# EAGLE schematic Central Board (EAGLE 8.3.2)
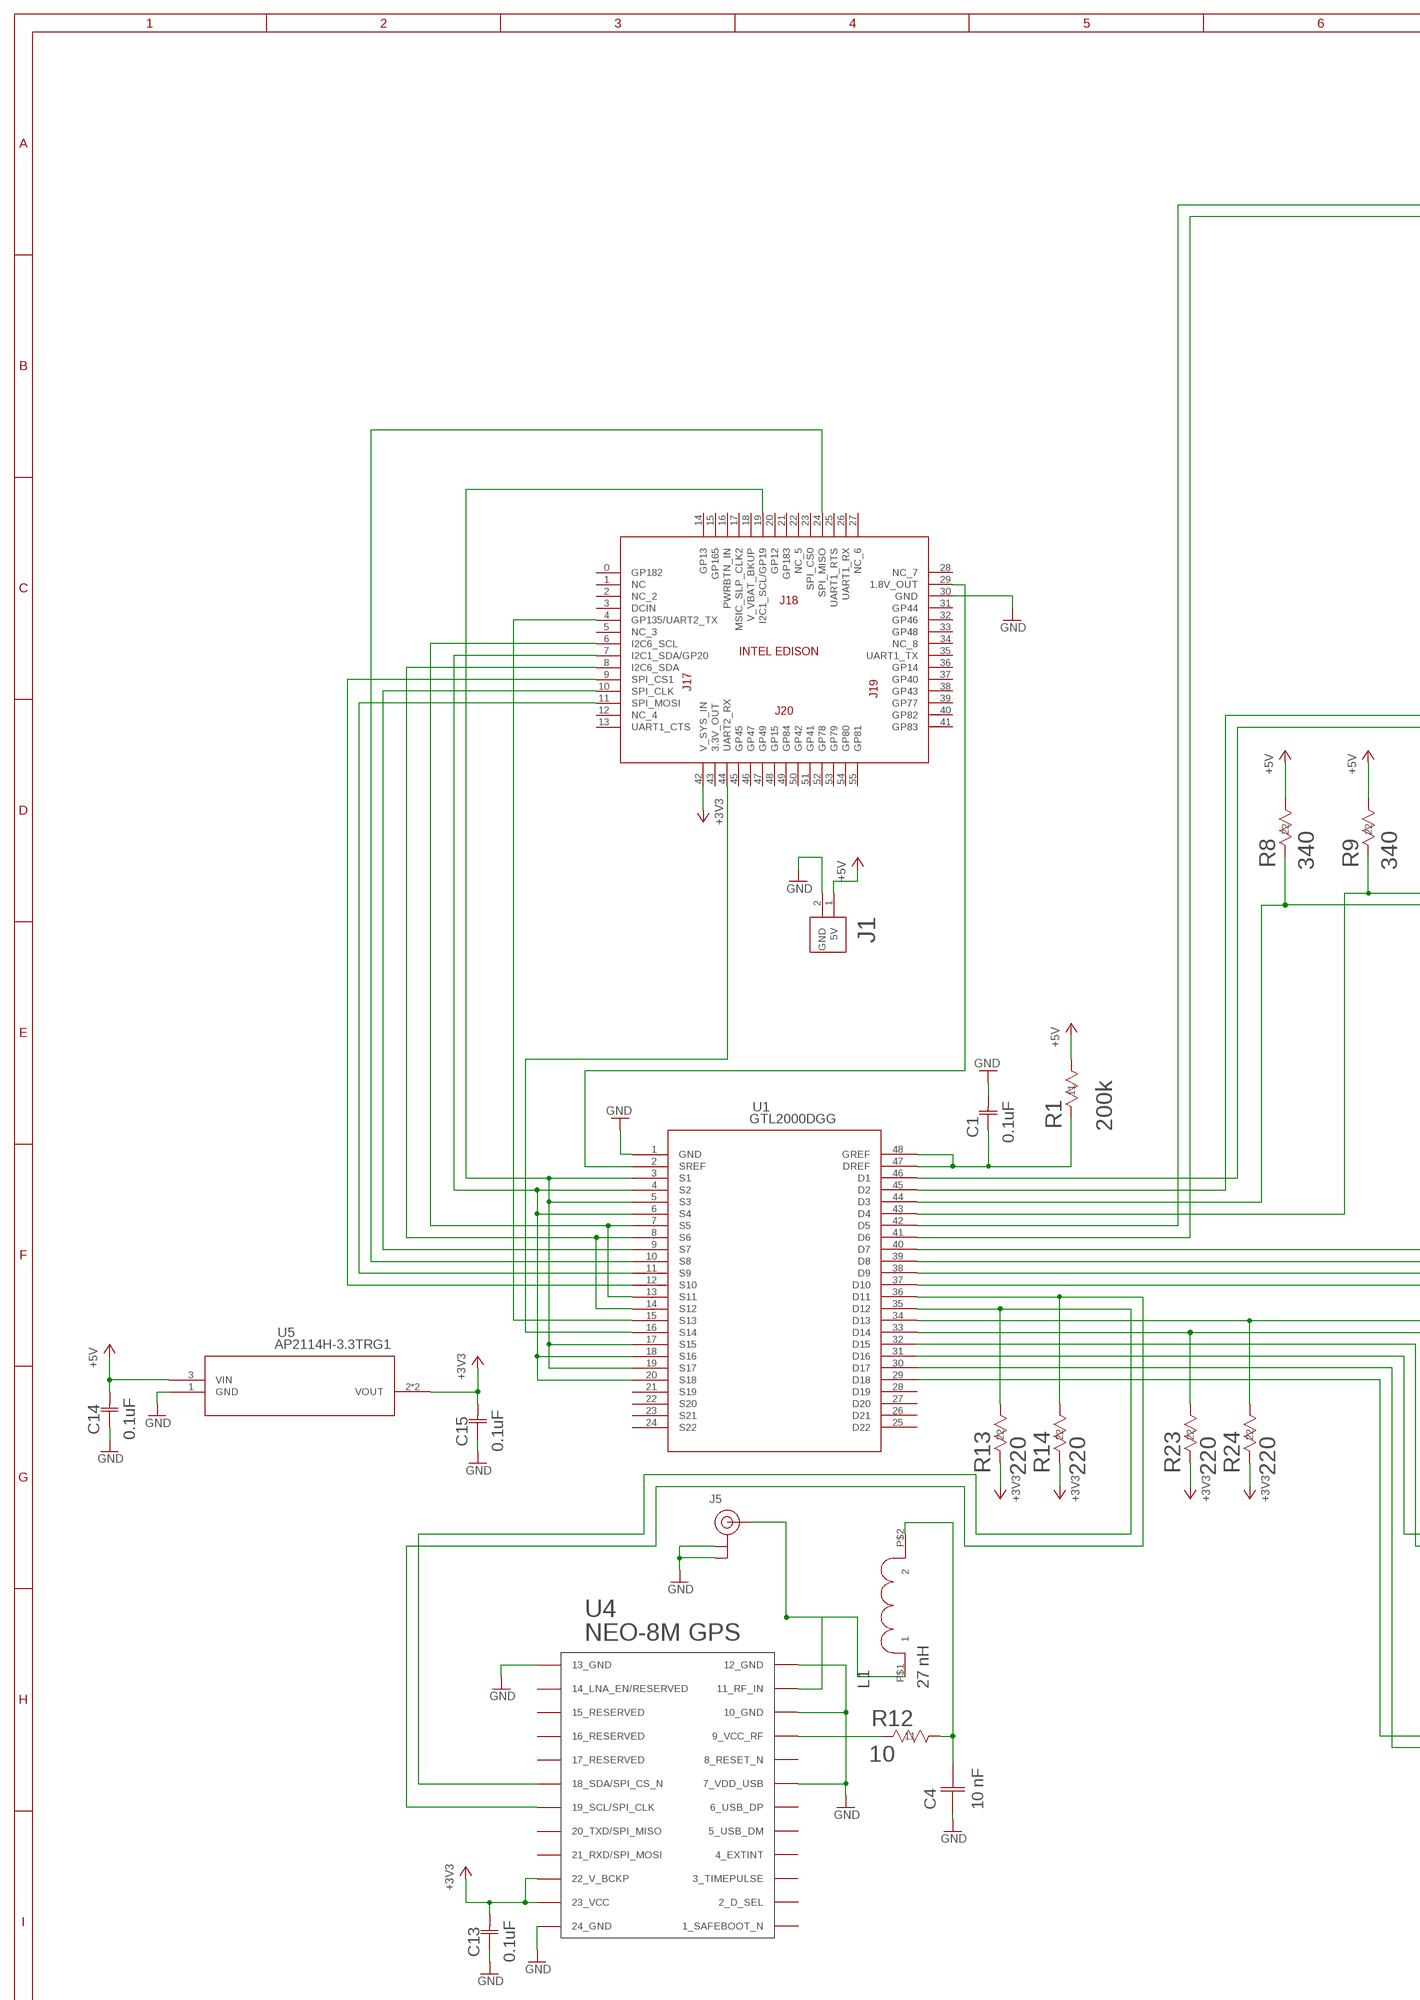
[diagram p0: schematic, sheet 1, part 1 of 2]
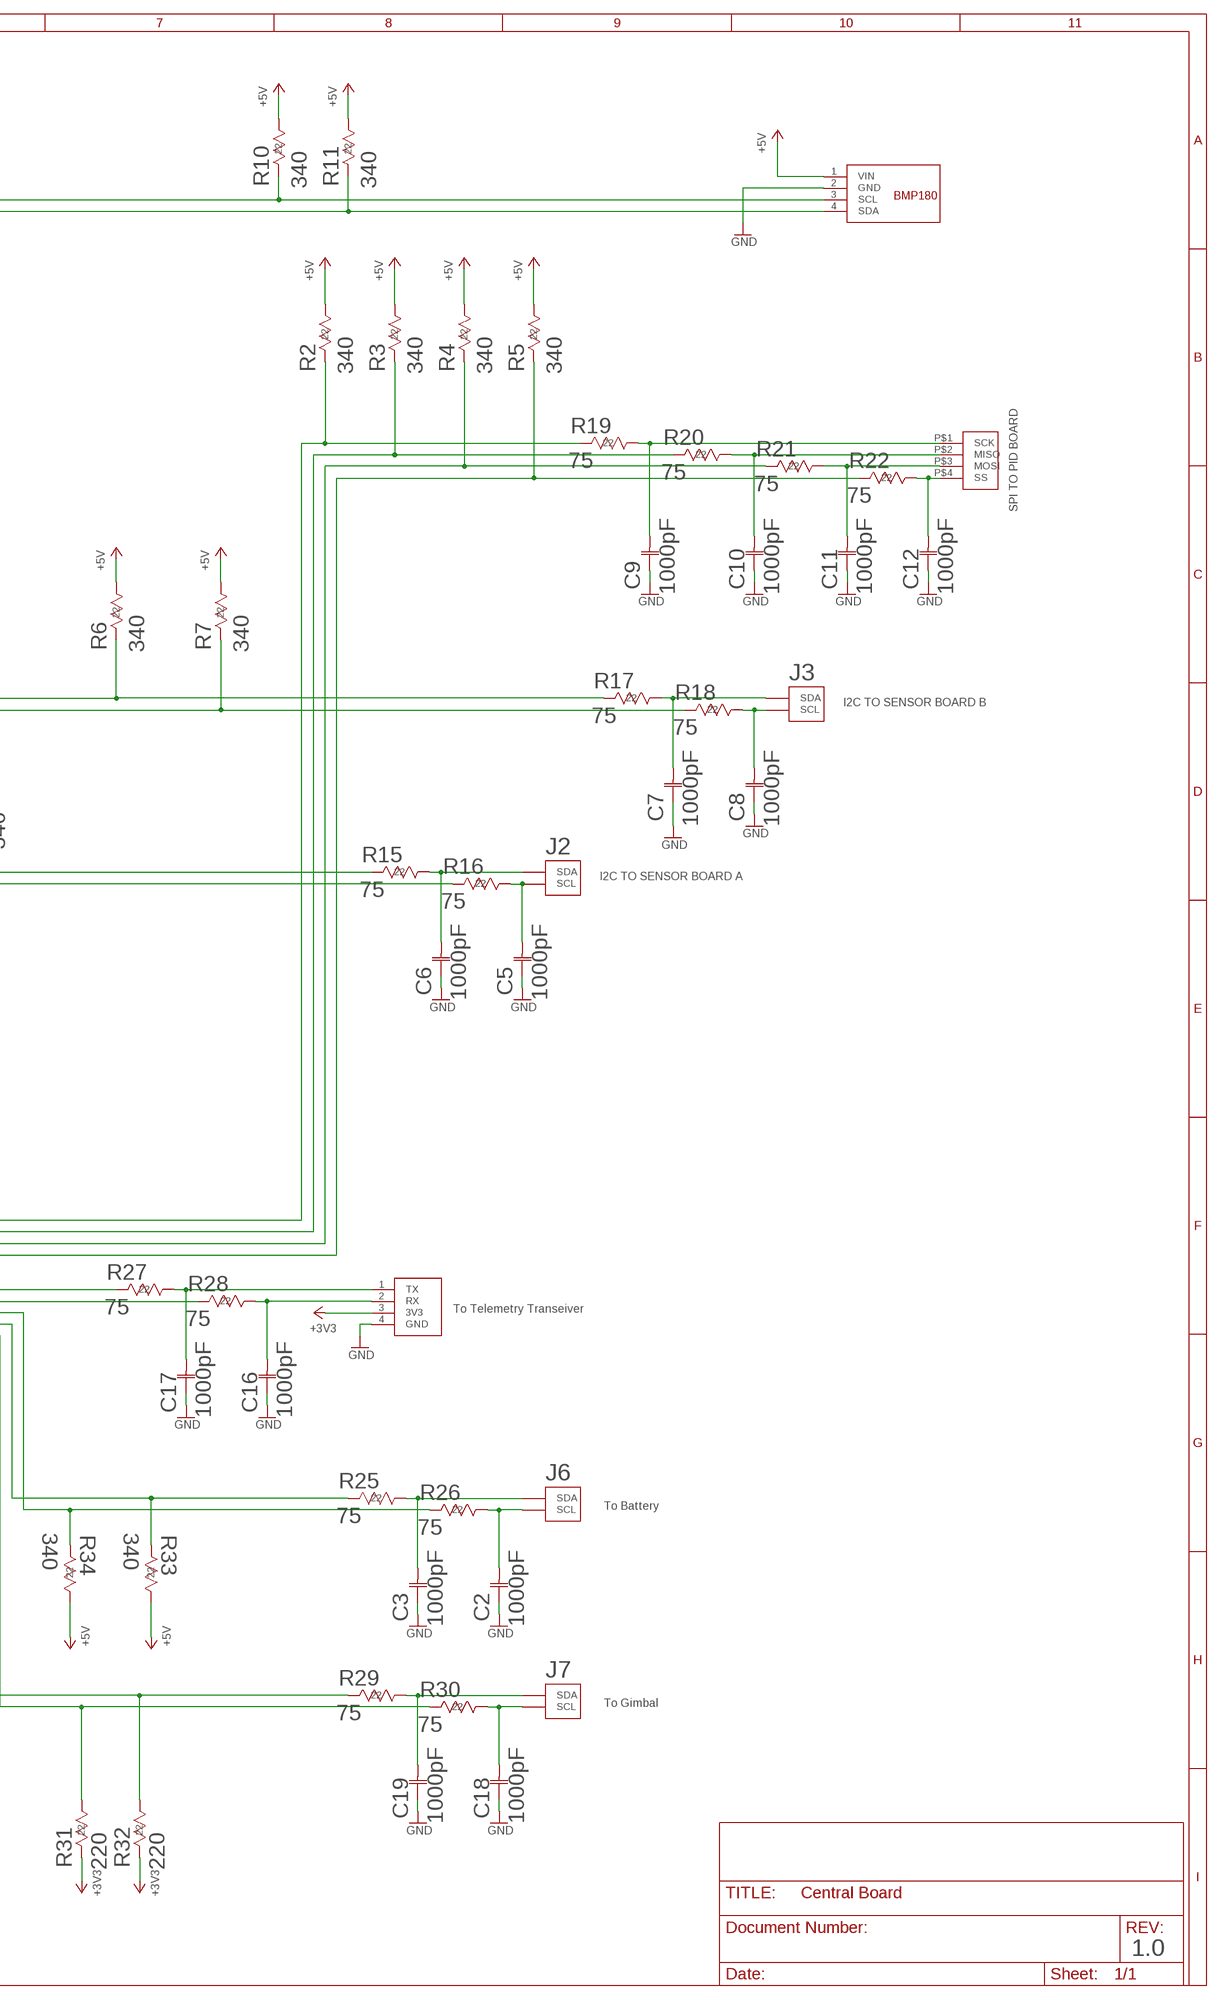
[diagram p1: schematic, sheet 1, part 2 of 2]

## Parts
C1  0.1uF  08055C104KAT2A  [0805]
C2  1000pF  GRM155R60J102KA01DG-155-M  [G-155-M]
C3  1000pF  GRM155R60J102KA01DG-155-M  [G-155-M]
C4  10 nF  10NF_CAPACITOR  [0603_CAPACITOR]
C5  1000pF  GRM155R60J102KA01DG-155-M  [G-155-M]
C6  1000pF  GRM155R60J102KA01DG-155-M  [G-155-M]
C7  1000pF  GRM155R60J102KA01DG-155-M  [G-155-M]
C8  1000pF  GRM155R60J102KA01DG-155-M  [G-155-M]
C9  1000pF  GRM155R60J102KA01DG-155-M  [G-155-M]
C10  1000pF  GRM155R60J102KA01DG-155-M  [G-155-M]
C11  1000pF  GRM155R60J102KA01DG-155-M  [G-155-M]
C12  1000pF  GRM155R60J102KA01DG-155-M  [G-155-M]
C13  0.1uF  08055C104KAT2A  [0805]
C14  0.1uF  08055C104KAT2A  [0805]
C15  0.1uF  08055C104KAT2A  [0805]
C16  1000pF  GRM155R60J102KA01DG-155-M  [G-155-M]
C17  1000pF  GRM155R60J102KA01DG-155-M  [G-155-M]
C18  1000pF  GRM155R60J102KA01DG-155-M  [G-155-M]
C19  1000pF  GRM155R60J102KA01DG-155-M  [G-155-M]
J1  POWER_CONNECTOR  [XH_CONNECTOR]
J2  I2C_CONNECTOR  [XH_CONNECTOR]
J3  I2C_CONNECTOR  [XH_CONNECTOR]
J4  SPI_CONNECTOR  [JST-XH_4POS]
J5  U.FL  [U.FL]
J6  I2C_CONNECTOR  [XH_CONNECTOR]
J7  I2C_CONNECTOR  [XH_CONNECTOR]
L1  27 nH  27NH_INDUCTOR  [0402_INDUCTOR]
R1  200k  RMCF0603FT200K  [STA_RMCF0603]
R2  340  RC0603FR-07340RL  [RC0603N]
R3  340  RC0603FR-07340RL  [RC0603N]
R4  340  RC0603FR-07340RL  [RC0603N]
R5  340  RC0603FR-07340RL  [RC0603N]
R6  340  RC0603FR-07340RL  [RC0603N]
R7  340  RC0603FR-07340RL  [RC0603N]
R8  340  RC0603FR-07340RL  [RC0603N]
R9  340  RC0603FR-07340RL  [RC0603N]
R10  340  RC0603FR-07340RL  [RC0603N]
R11  340  RC0603FR-07340RL  [RC0603N]
R12  10  RNCP0805FTD10R0STA_RNCP0805-M  [STA_RNCP0805-M]
R13  220  RC0603JR-07220RLRC0603N-M  [RC0603N-M]
R14  220  RC0603JR-07220RLRC0603N-M  [RC0603N-M]
R15  75  RC0402JR-0775RLRC0402N-M  [RC0402N-M]
R16  75  RC0402JR-0775RLRC0402N-M  [RC0402N-M]
R17  75  RC0402JR-0775RLRC0402N-M  [RC0402N-M]
R18  75  RC0402JR-0775RLRC0402N-M  [RC0402N-M]
R19  75  RC0402JR-0775RLRC0402N-M  [RC0402N-M]
R20  75  RC0402JR-0775RLRC0402N-M  [RC0402N-M]
R21  75  RC0402JR-0775RLRC0402N-M  [RC0402N-M]
R22  75  RC0402JR-0775RLRC0402N-M  [RC0402N-M]
R23  220  RC0603JR-07220RLRC0603N-M  [RC0603N-M]
R24  220  RC0603JR-07220RLRC0603N-M  [RC0603N-M]
R25  75  RC0402JR-0775RLRC0402N-M  [RC0402N-M]
R26  75  RC0402JR-0775RLRC0402N-M  [RC0402N-M]
R27  75  RC0402JR-0775RLRC0402N-M  [RC0402N-M]
R28  75  RC0402JR-0775RLRC0402N-M  [RC0402N-M]
R29  75  RC0402JR-0775RLRC0402N-M  [RC0402N-M]
R30  75  RC0402JR-0775RLRC0402N-M  [RC0402N-M]
R31  220  RC0603JR-07220RLRC0603N-M  [RC0603N-M]
R32  220  RC0603JR-07220RLRC0603N-M  [RC0603N-M]
R33  340  RC0603FR-07340RL  [RC0603N]
R34  340  RC0603FR-07340RL  [RC0603N]
U1  GTL2000DGG  [SOT362-1]
U3  INTEL_EDISON  [INTEL_EDISON]
U4  NEO-M8  [NEO-M8]
U5  AP2114H-3.3TRG1  [SOT-223]
U9  BMP180_BARO  [BMP180_BARO]
U$1  4_PIN_TELE_CONNECTOR  [4_PIN_TELE_CONNECTOR]

## Nets
+3V3: C13.2 C15.2 R13.2 R14.2 R23.2 R24.2 R31.2 R32.2 U3.42(V_SYS_IN) U4.22(22_V_BCKP) U4.23(23_VCC) U5.2(VOUT) U5.4(VOUT) U$1.3(3V3)
+5V: C14.2 J1.1(5V) R1.2 R2.1 R3.1 R4.1 R5.1 R6.1 R7.1 R8.1 R9.1 R10.1 R11.1 R33.1 R34.1 U5.3(VIN) U9.1(VIN)
GND: C1.2 C2.1 C3.1 C4.1 C5.1 C6.1 C7.1 C8.1 C9.1 C10.1 C11.1 C12.1 C13.1 C14.1 C15.1 C16.1 C17.1 C18.1 C19.1 J1.2(GND) J5.P$1(GND) J5.P$2(GND) U1.1(GND) U3.30(GND) U4.7(7_VDD_USB) U4.10(10_GND) U4.12(12_GND) U4.13(13_GND) U4.24(24_GND) U5.1(GND) U9.2(GND) U$1.4(GND)
N$1: J5.P$3(SIGNAL) L1.P$1 U4.11(11_RF_IN)
N$2: U1.3(S1) U1.5(S3) U1.17(S15) U1.19(S17) U3.19(I2C1_SCL/GP19)
N$3: U1.4(S2) U1.6(S4) U1.18(S16) U1.20(S18) U3.7(I2C1_SDA/GP20)
N$4: R7.2 R18.2 U1.46(D1)
N$5: R6.2 R17.2 U1.45(D2)
N$6: C18.2 J7.1(SCL) R30.1
N$7: R9.2 R15.2 U1.43(D4)
N$8: U1.7(S5) U1.13(S11) U3.6(I2C6_SCL)
N$9: U1.8(S6) U1.14(S12) U3.8(I2C6_SDA)
N$10: R10.2 U1.42(D5) U9.3(SCL)
N$11: U1.2(SREF) U3.29(1.8V_OUT)
N$12: R14.1 U1.36(D11) U4.19(19_SCL/SPI_CLK)
N$13: R12.1 U4.9(9_VCC_RF)
N$14: R11.2 U1.41(D6) U9.4(SDA)
N$15: U1.9(S7) U3.10(SPI_CLK)
N$16: C19.2 J7.2(SDA) R29.1
N$17: U1.10(S8) U3.24(SPI_MISO)
N$18: U1.16(S14) U3.44(UART2_RX)
N$19: U1.11(S9) U3.11(SPI_MOSI)
N$20: U1.15(S13) U3.4(GP135/UART2_TX)
N$21: U1.12(S10) U3.9(SPI_CS1)
N$22: R23.1 R28.2 U1.33(D14)
N$23: C1.1 R1.1 U1.47(DREF) U1.48(GREF)
N$24: R24.1 R27.2 U1.34(D13)
N$26: C4.2 L1.P$2 R12.2
N$27: R13.1 U1.35(D12) U4.18(18_SDA/SPI_CS_N)
N$28: C5.2 J2.1(SCL) R16.1
N$29: R8.2 R16.2 U1.44(D3)
N$30: C6.2 J2.2(SDA) R15.1
N$31: C8.2 J3.1(SCL) R18.1
N$32: C7.2 J3.2(SDA) R17.1
N$33: R30.2 R31.1 U1.30(D17)
N$34: C12.2 J4.P$4(SS) R22.1
N$35: C11.2 J4.P$3(MOSI) R21.1
N$36: C9.2 J4.P$1(SCK) R19.1
N$37: C10.2 J4.P$2(MISO) R20.1
N$38: C2.2 J6.1(SCL) R26.1
N$39: R29.2 R32.1 U1.29(D18)
N$40: C3.2 J6.2(SDA) R25.1
N$42: C16.2 R28.1 U$1.2(RX)
N$43: R25.2 R33.2 U1.31(D16)
N$44: C17.2 R27.1 U$1.1(TX)
N$45: R26.2 R34.2 U1.32(D15)
N$52: R5.2 R22.2 U1.37(D10)
N$53: R4.2 R21.2 U1.38(D9)
N$54: R3.2 R20.2 U1.39(D8)
N$55: R2.2 R19.2 U1.40(D7)
Unconnected: U1.21(S19) U1.22(S20) U1.23(S21) U1.24(S22) U1.25(D22) U1.26(D21) U1.27(D20) U1.28(D19) U3.0(GP182) U3.1(NC) U3.2(NC_2) U3.5(NC_3) U3.12(NC_4) U3.13(UART1_CTS) U3.14(GP13) U3.15(GP165) U3.20(GP12) U3.21(GP183) U3.22(NC_5) U3.23(SPI_CS0) U3.25(UART1_RTS) U3.26(UART1_RX) U3.27(NC_6) U3.28(NC_7) U3.31(GP44) U3.32(GP46) U3.33(GP48) U3.34(NC_8) U3.35(UART1_TX) U3.36(GP14) U3.37(GP40) U3.38(GP43) U3.39(GP77) U3.40(GP82) U3.41(GP83) U3.45(GP45) U3.46(GP47) U3.47(GP49) U3.48(GP15) U3.49(GP84) U3.50(GP42) U3.51(GP41) U3.52(GP78) U3.53(GP79) U3.54(GP80) U3.55(GP81) U4.1(1_SAFEBOOT_N) U4.2(2_D_SEL) U4.3(3_TIMEPULSE) U4.4(4_EXTINT) U4.5(5_USB_DM) U4.6(6_USB_DP) U4.8(8_RESET_N) U4.14(14_LNA_EN/RESERVED) U4.15(15_RESERVED) U4.16(16_RESERVED) U4.17(17_RESERVED) U4.20(20_TXD/SPI_MISO) U4.21(21_RXD/SPI_MOSI)

## Notes on the sheet
- SPI TO PID BOARD
- I2C TO SENSOR BOARD B
- I2C TO SENSOR BOARD A
- To Telemetry Transeiver
- To Battery
- To Gimbal
- 1.0

## Power pins joined to a net without a drawn wire
3.3V_OUT: U3.43(3.3V_OUT)
DCIN: U3.3(DCIN)
MSIC_SLP_CLK2: U3.17(MSIC_SLP_CLK2)
PWRBTN_IN: U3.16(PWRBTN_IN)
V_VBAT_BKUP: U3.18(V_VBAT_BKUP)

## Library data of the parts
C1 C13-C15 = 0.1uF X7R Ceramic Capacitor:08055C104KAT2A; COPYRIGHT: Copyright C 2015 Accelerated Designs. All rights reserved; MANUFACTURER_PART_NUMBER: 08055C104KAT2A; VENDOR: Vendor
C2 C3 C5-C12 C16-C19 = 1000pF-capacitor:GRM155R60J102KA01D; COPYRIGHT: Copyright C 2015 Accelerated Designs. All rights reserved; MANUFACTURER_PART_NUMBER: GRM155R60J102KA01D; VENDOR: Vendor
C4 = thanics_robotics:10NF_CAPACITOR
J1 = thanics_robotics:POWER_CONNECTOR
J2 J3 J6 J7 = thanics_robotics:I2C_CONNECTOR
J4 = thanics_robotics:SPI_CONNECTOR
J5 = SparkFun-Connectors:U.FL: SMD Antenna Connector - U.FL 2mm height, 3.0mm x 3.0mm receptacle size. SparkFun Products: SparkFun WiFi Shield - ESP8266 <https://www.sparkfun.com/products/13287> SparkFun ESP8266 Thing <https://www.sparkfun.com/products/13231> SparkFun MiniGen - Pro Mini Signal Generator Shield <https://www.sparkfun.com/products/11420>; PROD_ID: CONN-09193; SF_ID: WRL-09144
L1 = thanics_robotics:27NH_INDUCTOR
R1 = 200k-resistor:RMCF0603FT200K; COPYRIGHT: Copyright C 2015 Accelerated Designs. All rights reserved; MANUFACTURER_PART_NUMBER: RMCF0603FT200K; VENDOR: Vendor
R2-R11 R33 R34 = 340-resistor:RC0603FR-07340RL; CASE: 0603 1608 metric; COMPOSITION: Thick Film; COPYRIGHT: Copyright C 2015 Accelerated Designs. All rights reserved; DATASHEET: httpwww.yageo.comdocumentsrecentPYuRC0603_51_RoHS_L_4.pdf; DIGIKEYPARTNUMBER: 311340HRTRND; HEIGHT: 0.022" 0.55mm; LEADSTYLE: Surface Mount SMD SMT; MANUFACTURER_PART_NUMBER: RC0603FR07340RL; NEWARKPARTNUMBER: 66R2325; NUMBEROFTERMINATIONS: 2; PACKAGECASE: 0603 1608 Metric; PACKAGING: Tape &amp Reel TR; POWERWATTS: 0.1W 110W; QUANTITY_AVAILABLE: 95000; RESISTANCEINOHMS: 340; RESISTANCEOHMS: 340; SIZEDIMENSION: 0.063" L x 0.031" W 1.60mm x 0.80mm; TEMPERATURECOEFFICIENT: 100ppm°C; TOLERANCE: 1%; VENDOR: Yageo; VOLTAGEWORKING: 50V
R12 = 10-resistor:RNCP0805FTD10R0; COPYRIGHT: Copyright C 2015 Accelerated Designs. All rights reserved; MANUFACTURER_PART_NUMBER: RNCP0805FTD10R0; VENDOR: Vendor
R13 R14 R23 R24 R31 R32 = 220-resistor:RC0603JR-07220RL; CASE: 0603 1608 metric; COMPOSITION: Thick Film; COPYRIGHT: Copyright C 2015 Accelerated Designs. All rights reserved; DATASHEET: httpwww.yageo.comdocumentsrecentPYuRC0603_51_RoHS_L_4.pdf; DESCRIPTION: RES 220 OHM 110W 5% 0603 SMD; DIGIKEYPARTNUMBER: 311220GRTRND; HEIGHT: 0.022" 0.55mm; LEADSTYLE: Surface Mount SMD SMT; MANUFACTURER_PART_NUMBER: RC0603JR07220RL; NEWARKPARTNUMBER: 68R0170; NUMBEROFTERMINATIONS: 2; PACKAGECASE: 0603 1608 Metric; PACKAGING: Tape &amp Reel TR; POWERWATTS: 0.1W 110W; QUANTITY_AVAILABLE: 425000; RESISTANCEINOHMS: 220; RESISTANCEOHMS: 220; SIZEDIMENSION: 0.063" L x 0.031" W 1.60mm x 0.80mm; TEMPERATURECOEFFICIENT: 100ppm°C; TOLERANCE: 5%; VENDOR: Yageo; VOLTAGEWORKING: 50V
R15-R22 R25-R30 = 75-resistor:RC0402JR-0775RL; CASE: 0402 1005 metric; COMPOSITION: Thick Film; COPYRIGHT: Copyright C 2015 Accelerated Designs. All rights reserved; DATASHEET: httpwww.yageo.comdocumentsrecentPYuRC0402_51_RoHS_L_6.pdf; DESCRIPTION: RES 75 OHM 116W 5% 0402 SMD; DIGIKEYPARTNUMBER: 31175JRTRND; HEIGHT: 0.016" 0.40mm; LEADSTYLE: Surface Mount SMD SMT; MANUFACTURER_PART_NUMBER: RC0402JR0775RL; NEWARKPARTNUMBER: 66R1890; NUMBEROFTERMINATIONS: 2; PACKAGECASE: 0402 1005 Metric; PACKAGING: Tape &amp Reel TR; POWERWATTS: 0.063W 116W; QUANTITY_AVAILABLE: 60000; RESISTANCEINOHMS: 75.0; RESISTANCEOHMS: 75; SIZEDIMENSION: 0.039" L x 0.020" W 1.00mm x 0.50mm; TEMPERATURECOEFFICIENT: 100ppm°C; TOLERANCE: 5%; VENDOR: Yageo; VOLTAGEWORKING: 50V
U1 = GTL2000DGG:GTL2000DGG; COPYRIGHT: Copyright C 2015 Accelerated Designs. All rights reserved; MANUFACTURER_PART_NUMBER: GTL2000DGG; VENDOR: NXP
U3 = thanics_robotics:INTEL_EDISON
U4 = ubloxLib:NEO-M8: u-blox NEO GNSS module
U5 = 3.3V regulator:AP2114H-3.3TRG1; MANUFACTURER_PART_NUMBER: ap2114h3.3trg1; VENDOR: DIODESINC_2
U9 = thanics_robotics:BMP180_BARO
U$1 = thanics_robotics:4_PIN_TELE_CONNECTOR